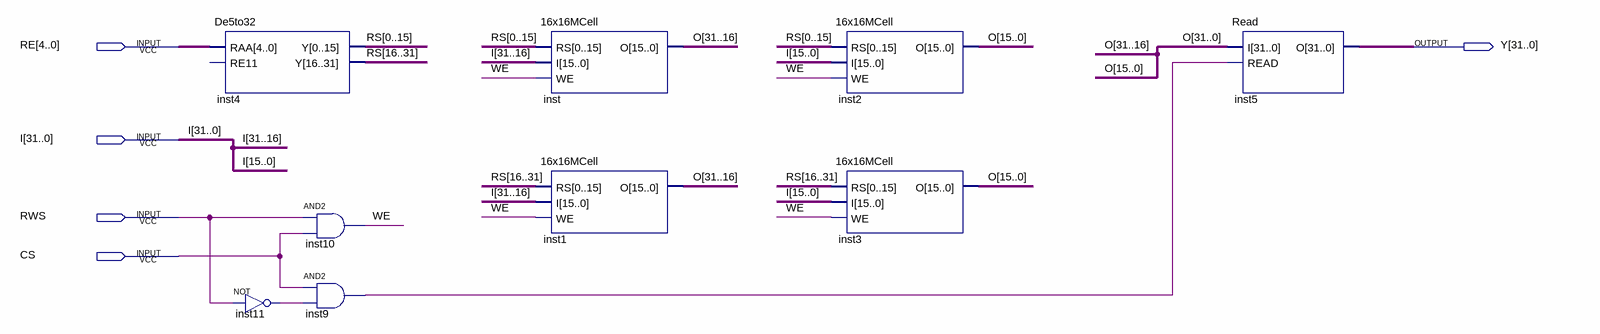
[diagram p0: schematic sheet]
// Quartus schematic Ram32x32.bdf as structural Verilog: 9 symbols, 5 pins
module Ram32x32 (
  input  [4:0] RE,
  input  [31:0] I,
  input  RWS,
  input  CS,
  output [31:0] Y
);

  wire inst9_out, inst11_out, WE;
  wire [31:0] O, RS;

  De5to32 inst4 (.RAA(RE), .Y(RS));  // open: RE11
  not inst11 (inst11_out, RWS);
  and inst10 (WE, RWS, CS);
  and inst9 (inst9_out, CS, inst11_out);
  \16x16MCell  inst (
    .RS({RS[0], RS[1], RS[2], RS[3], RS[4], RS[5], RS[6], RS[7], RS[8], RS[9], RS[10], RS[11], RS[12], RS[13], RS[14], RS[15]}),
    .I(I[31:16]), .WE(WE), .O(O[31:16]));
  \16x16MCell  inst1 (
    .RS({RS[16], RS[17], RS[18], RS[19], RS[20], RS[21], RS[22], RS[23], RS[24], RS[25], RS[26], RS[27], RS[28], RS[29], RS[30], RS[31]}),
    .I(I[31:16]), .WE(WE), .O(O[31:16]));
  \16x16MCell  inst2 (
    .RS({RS[0], RS[1], RS[2], RS[3], RS[4], RS[5], RS[6], RS[7], RS[8], RS[9], RS[10], RS[11], RS[12], RS[13], RS[14], RS[15]}),
    .I(I[15:0]), .WE(WE), .O(O[15:0]));
  \16x16MCell  inst3 (
    .RS({RS[16], RS[17], RS[18], RS[19], RS[20], RS[21], RS[22], RS[23], RS[24], RS[25], RS[26], RS[27], RS[28], RS[29], RS[30], RS[31]}),
    .I(I[15:0]), .WE(WE), .O(O[15:0]));
  Read inst5 (.I(O), .READ(inst9_out), .O(Y));
endmodule
